# Altium schematic sheet 200_MCU.SchDoc: TempeMaxMCU
size A4; DocumentNumber: 1; Revision: 0.1; SheetNumber: 3; SheetTotal: 4
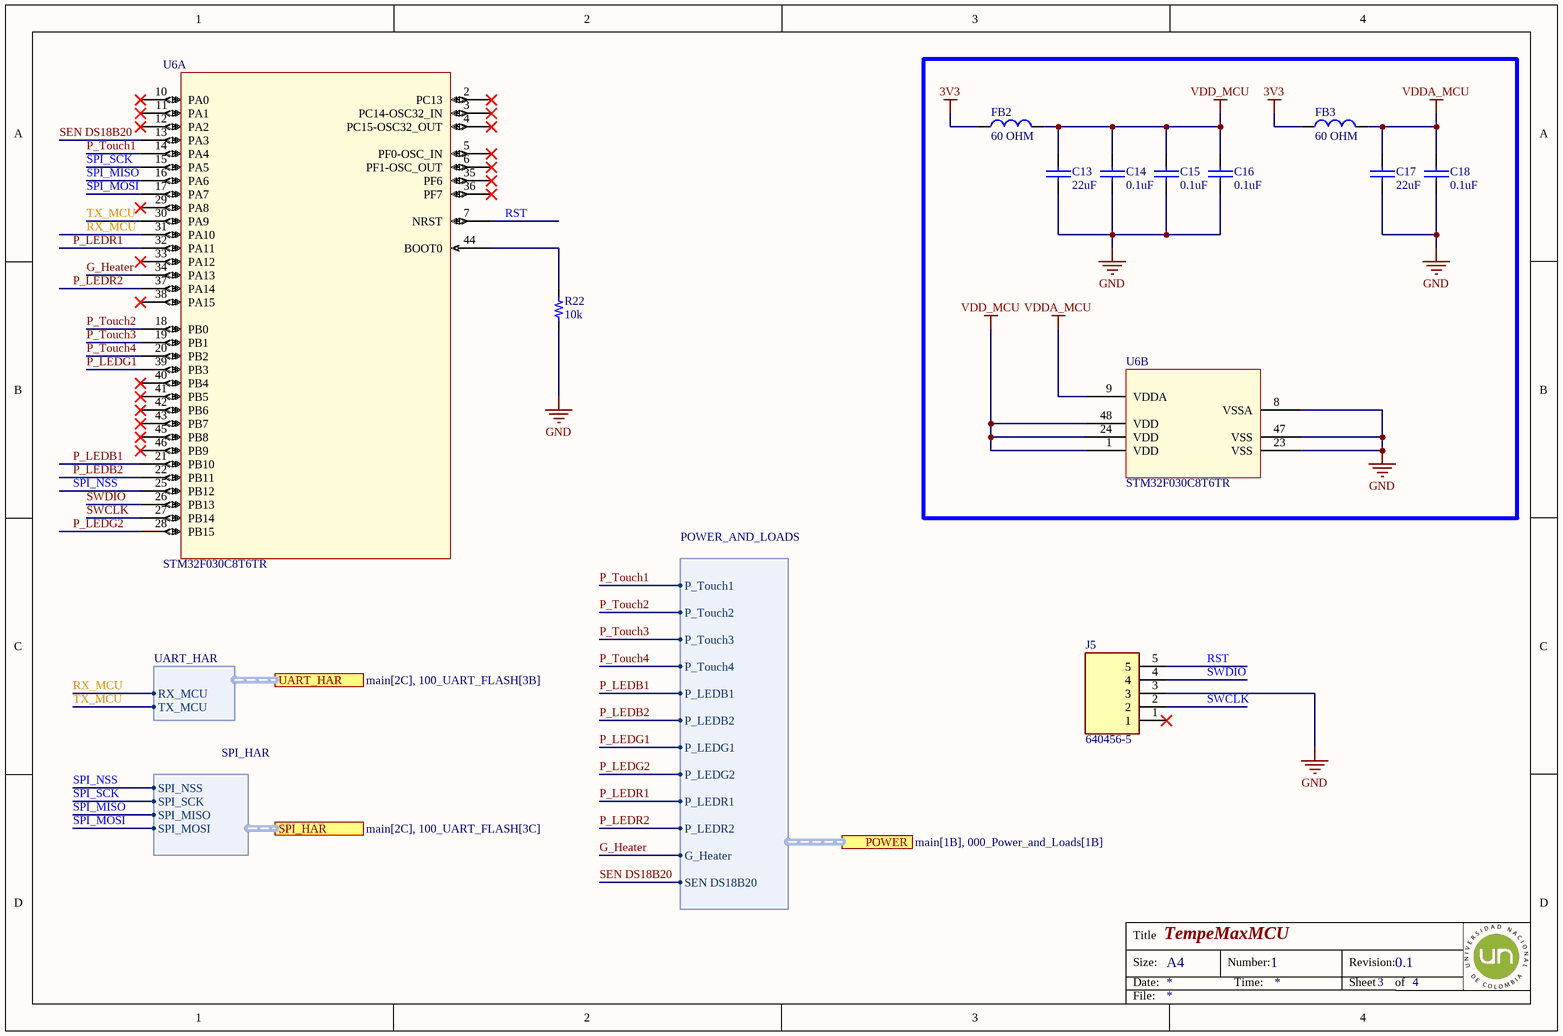
[diagram p0: 200_MCU.SchDoc]

## Parts
C13  value 22uF  [0603_cap]  (hidden comment: 22uF 6V3)
C14  value 0.1uF  [0603_cap]  (hidden comment: 0.1uF 50V)
C15  value 0.1uF  [0603_cap]  (hidden comment: 0.1uF 50V)
C16  value 0.1uF  [0603_cap]  (hidden comment: 0.1uF 50V)
C17  value 22uF  [0603_cap]  (hidden comment: 22uF 6V3)
C18  value 0.1uF  [0603_cap]  (hidden comment: 0.1uF 50V)
FB2  value 60 OHM  [0603_fb]  (hidden comment: 60OHM 2A)
FB3  value 60 OHM  [0603_fb]  (hidden comment: 60OHM 2A)
J5  640456-5  [TE_640456-5]
R22  value 10k  [0603_res]  (hidden comment: 10k 1/10W)
U6  STM32F030C8T6TR  [LQFP48_7x7mm]  (parts A,B of 2)

## Ports
POWER (harness POWER_AND_LOADS, see main[1B], 000_Power_and_Loads[1B]), SPI_HAR (harness SPI_HAR, see main[2C], 100_UART_FLASH[3C]), UART_HAR (harness UART_HAR, see main[2C], 100_UART_FLASH[3B])

## Harnesses
SPI_HAR: SPI_NSS, SPI_SCK, SPI_MISO, SPI_MOSI
POWER_AND_LOADS: P_Touch1, P_Touch2, P_Touch3, P_Touch4, P_LEDB1, P_LEDB2, P_LEDG1, P_LEDG2, P_LEDR1, P_LEDR2, G_Heater, SEN DS18B20
UART_HAR: RX_MCU, TX_MCU

## Nets
3V3: FB2.1 FB3.1
GND: C13.2 C14.2 C15.2 C16.2 C17.2 C18.2 J5.3 R22.1 U6.8(VSSA) U6.23(VSS) U6.47(VSS)
VDD_MCU: C13.1 C14.1 C15.1 C16.1 FB2.2 U6.1(VDD) U6.24(VDD) U6.48(VDD)
VDDA_MCU: C17.1 C18.1 FB3.2 U6.9(VDDA)
G_Heater: U6.34(PA13) ; port POWER.G_Heater
P_LEDB1: U6.21(PB10) ; port POWER.P_LEDB1
P_LEDB2: U6.22(PB11) ; port POWER.P_LEDB2
P_LEDG1: U6.39(PB3) ; port POWER.P_LEDG1
P_LEDG2: U6.28(PB15) ; port POWER.P_LEDG2
P_LEDR1: U6.32(PA11) ; port POWER.P_LEDR1
P_LEDR2: U6.37(PA14) ; port POWER.P_LEDR2
P_Touch1: U6.14(PA4) ; port POWER.P_Touch1
P_Touch2: U6.18(PB0) ; port POWER.P_Touch2
P_Touch3: U6.19(PB1) ; port POWER.P_Touch3
P_Touch4: U6.20(PB2) ; port POWER.P_Touch4
RST: J5.5 U6.7(NRST)
RX_MCU: U6.31(PA10) ; port UART_HAR.RX_MCU
SEN DS18B20: U6.13(PA3) ; port POWER.SEN DS18B20
SPI_MISO: U6.16(PA6) ; port SPI_HAR.SPI_MISO
SPI_MOSI: U6.17(PA7) ; port SPI_HAR.SPI_MOSI
SPI_NSS: U6.25(PB12) ; port SPI_HAR.SPI_NSS
SPI_SCK: U6.15(PA5) ; port SPI_HAR.SPI_SCK
SWCLK: J5.2 U6.27(PB14)
SWDIO: J5.4 U6.26(PB13)
TX_MCU: U6.30(PA9) ; port UART_HAR.TX_MCU
NetR22_2: R22.2 U6.44(BOOT0)

Not connected (* = marked no-connect by the designer): J5 1*; U6 2(PC13)* 3(PC14-OSC32_IN)* 4(PC15-OSC32_OUT)* 5(PF0-OSC_IN)* 6(PF1-OSC_OUT)* 10(PA0)* 11(PA1)* 12(PA2)* 29(PA8)* 33(PA12)* 35(PF6)* 36(PF7)* 38(PA15)* 40(PB4)* 41(PB5)* 42(PB6)* 43(PB7)* 45(PB8)* 46(PB9)*

## Notes on the sheet
- Title
- Size:
- Date:
- A4
- Number:
- Time:
- Revision:
- Sheet
- of
- File:

## Library data of the parts
C13 C17 = Cap_22uF_0805_6V3: 6.3V 22uF X5R ±20% 0805 Multilayer Ceramic Capacitors MLCC - SMD/SMT ROHS; Manufacturer: Samsung Electro-Mechanics; Manufacturer Part Number: CL21A226MQQNNNE; Supplier 1: LCSC; Supplier Part Number 1: C5674; ComponentLink1Description: LCSC; ComponentLink1URL: https://www.lcsc.com/product-detail/Multilayer-Ceramic-Capacitors-MLCC-SMD-SMT_Samsung-Electro-Mechanics-CL21A226MQQNNNE_C5674.html
C14-C16 C18 = Cap_0.1uF_0603_50V: 50V 100nF Y5V -20%~+80% 0603 Multilayer Ceramic Capacitors MLCC - SMD/SMT ROHS; Manufacturer: Walsin Tech Corp; Manufacturer Part Number: 0603F104Z500CT; Supplier 1: LCSC; Supplier Part Number 1: C83060; ComponentLink1Description: LCSC; ComponentLink1URL: https://www.lcsc.com/product-detail/Multilayer-Ceramic-Capacitors-MLCC-SMD-SMT_Walsin-Tech-Corp-0603F104Z500CT_C83060.html
FB2 FB3 = FB_60_0603_2A: 2A 1 100mΩ 60Ω@100MHz ±25% 0603 Ferrite Beads ROHS; Manufacturer: TAI-TECH; Manufacturer Part Number: HCB1608KF-600T20; ComponentLink1Description: LCSC; ComponentLink1URL: https://www.lcsc.com/product-detail/Ferrite-Beads_TAI-TECH-HCB1608KF-600T20_C369516.html; Supplier 1: LCSC; Supplier Part Number 1: C369516
J5 = 640456-5: Header, Friction Lock; MTA-100; 5; 250 VAC; Polyester; Tin; Copper Alloy; Tin; Manufacturer: TE Connectivity; Number_of_Positions: 5; Product_Type: Connector; Centerline_Pitch: 2.54 mm[.1 in]; Value: *; Supplier part number 1: A19471-ND; SnapEDA_Link: https://www.snapeda.com/parts/640456-5/TE%20Connectivity%20AMP%20Connectors/view-part/381420/?ref=snap; TE_purchase_URL: https://www.te.com/usa-en/product-640456-5.html?te_bu=Cor&te_type=disp&te_campaign=seda_glo_cor-seda-global-disp-prtnr-fy19-seda-model-bom-cta_sma-317_1&elqCampaignId=32493; Package: None; MP: 640456-5; Digi-Key_Purchase_URL: https://www.digikey.com/product-detail/en/te-connectivity-amp-connectors/640456-5/A19471-ND/259011?utm_source=snapeda&utm_medium=aggregator&utm_campaign=symbol; EU_RoHS_Compliance: Compliant; Manufacturer part number: 640456-5; ComponentLink1Description: Digi Key; ComponentLink1URL: https://www.digikey.com/en/products/detail/te-connectivity-amp-connectors/640456-5/259011?s=N4IgTCBcDaIIIEYCcAWA7AgtAOQCIgF0BfIA; Supplier 1: Digi-Key
R22 = Res_10k_0603_1/10W: RES SMD 10k OHM 5% 1/10W 0603; Manufacturer: FOJAN; Manufacturer Part Number: FRC0603J103TS; ComponentLink1URL: https://www.lcsc.com/product-detail/Chip-Resistor-Surface-Mount_FOJAN-FRC0603J103TS_C2930027.html; Supplier 1: LCSC; Supplier Part Number 1: C2930027; ComponentLink1Description: LCSC
U6 = IC_STM32F030C8T6TR_LQFP48_7x7MM: IC MCU 32BIT 64KB FLASH 48LQFP; Manufacturer: STMicroelectronics; Manufacturer part number: STM32F030C8T6TR; Supplier 1: LCSC; Supplier Part Number 1: C23922; ComponentLink1Description: LCSC; ComponentLink1URL: https://www.lcsc.com/product-detail/ST-Microelectronics_STMicroelectronics-STM32F030C8T6_C23922.html